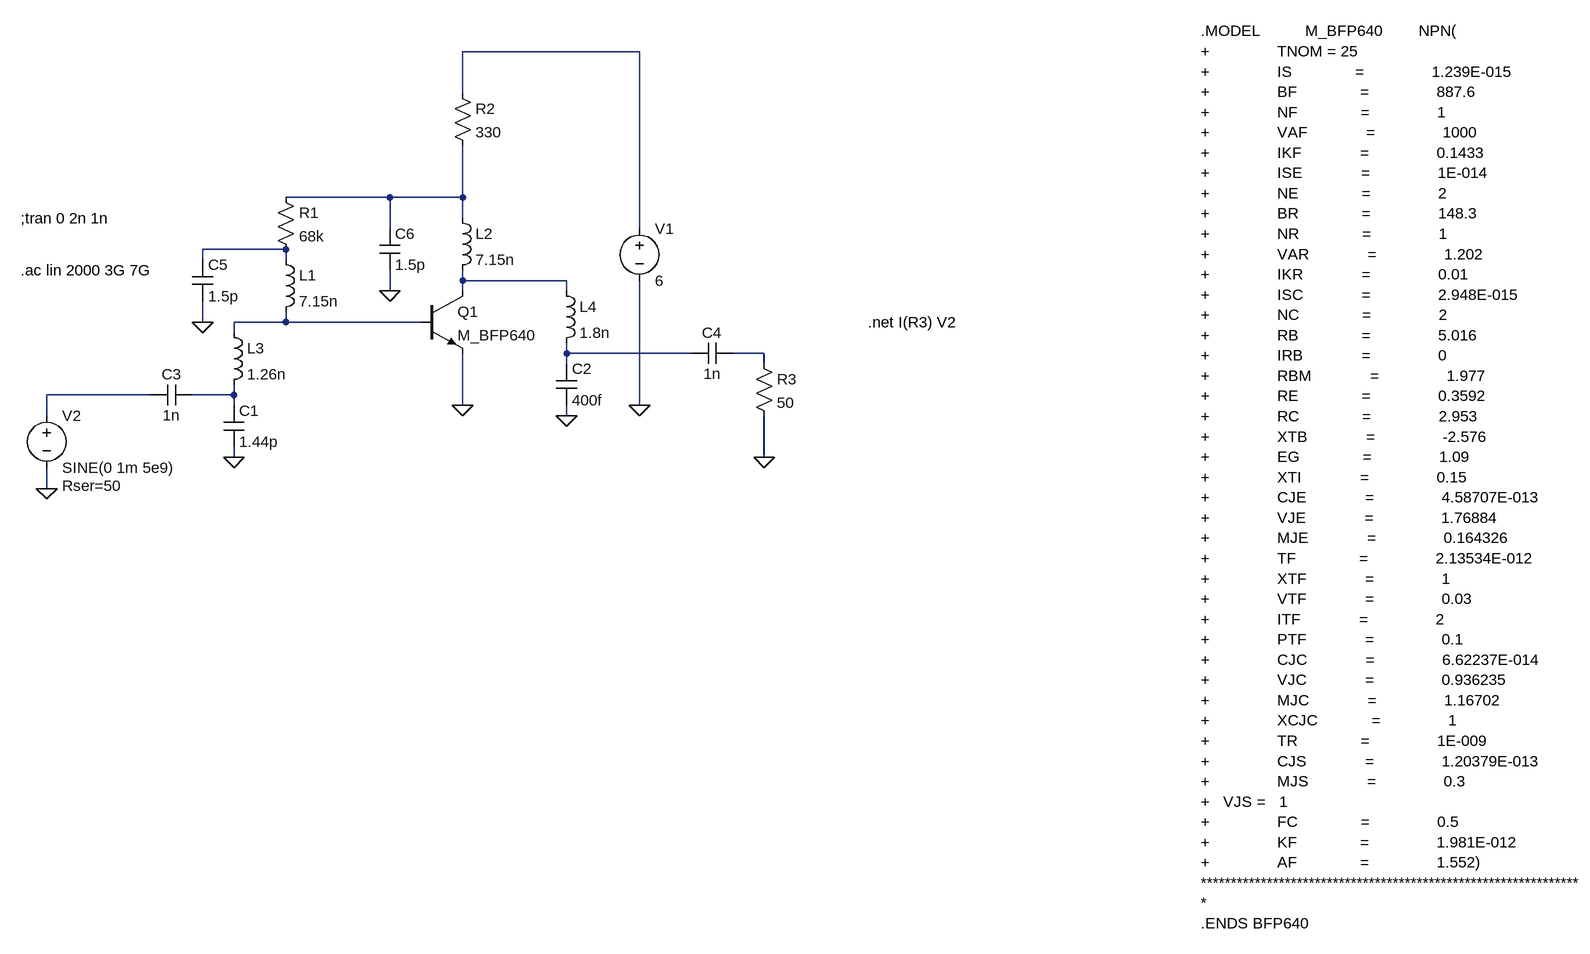
[diagram p0: schematic bfp640_single_stage_dcop.asc]
bfp640_single_stage_dcop.asc, the LTspice schematic file:
Version 4
SHEET 1 1148 1300
WIRE -640 64 -912 64
WIRE -912 128 -912 64
WIRE -1024 288 -1184 288
WIRE -912 288 -912 208
WIRE -912 288 -1024 288
WIRE -912 320 -912 288
WIRE -1024 336 -1024 288
WIRE -640 336 -640 64
WIRE -1184 368 -1312 368
WIRE -1312 384 -1312 368
WIRE -1184 384 -1184 368
WIRE -912 416 -912 400
WIRE -752 416 -912 416
WIRE -1024 432 -1024 400
WIRE -912 432 -912 416
WIRE -752 432 -752 416
WIRE -1312 480 -1312 448
WIRE -1184 480 -1184 464
WIRE -1184 480 -1264 480
WIRE -976 480 -1184 480
WIRE -1264 496 -1264 480
WIRE -752 528 -752 512
WIRE -560 528 -752 528
WIRE -448 528 -496 528
WIRE -752 544 -752 528
WIRE -448 544 -448 528
WIRE -1392 592 -1552 592
WIRE -1264 592 -1264 576
WIRE -1264 592 -1328 592
WIRE -1264 608 -1264 592
WIRE -912 608 -912 528
WIRE -640 608 -640 416
WIRE -1552 624 -1552 592
WIRE -752 624 -752 608
WIRE -1264 688 -1264 672
WIRE -448 688 -448 624
WIRE -1552 736 -1552 704
FLAG -912 608 0
FLAG -640 608 0
FLAG -1264 688 0
FLAG -752 624 0
FLAG -1552 736 0
FLAG -448 688 0
FLAG -1312 480 0
FLAG -1024 432 0
DATAFLAG -912 560 ""
DATAFLAG -912 400 ""
SYMBOL res -1200 272 R0
SYMATTR InstName R1
SYMATTR Value 68k
SYMBOL res -928 112 R0
SYMATTR InstName R2
SYMATTR Value 330
SYMBOL npn -976 432 R0
SYMATTR InstName Q1
SYMATTR Value M_BFP640
SYMBOL voltage -640 320 R0
WINDOW 123 0 0 Left 0
WINDOW 39 0 0 Left 0
SYMATTR InstName V1
SYMATTR Value 6
SYMBOL ind -1200 368 R0
SYMATTR InstName L1
SYMATTR Value 7.15n
SYMBOL ind -928 304 R0
SYMATTR InstName L2
SYMATTR Value 7.15n
SYMBOL ind -1280 480 R0
SYMATTR InstName L3
SYMATTR Value 1.26n
SYMBOL cap -1280 608 R0
SYMATTR InstName C1
SYMATTR Value 1.44p
SYMBOL cap -1328 576 R90
WINDOW 0 0 32 VBottom 2
WINDOW 3 32 32 VTop 2
SYMATTR InstName C3
SYMATTR Value 1n
SYMBOL cap -496 512 R90
WINDOW 0 0 32 VBottom 2
WINDOW 3 32 32 VTop 2
SYMATTR InstName C4
SYMATTR Value 1n
SYMBOL voltage -1552 608 R0
WINDOW 123 0 0 Left 0
WINDOW 39 24 124 Left 2
SYMATTR InstName V2
SYMATTR Value SINE(0 1m 5e9)
SYMATTR SpiceLine Rser=50
SYMBOL res -464 528 R0
SYMATTR InstName R3
SYMATTR Value 50
SYMBOL cap -768 544 R0
SYMATTR InstName C2
SYMATTR Value 400f
SYMBOL ind -768 416 R0
SYMATTR InstName L4
SYMATTR Value 1.8n
SYMBOL cap -1328 384 R0
SYMATTR InstName C5
SYMATTR Value 1.5p
SYMBOL cap -1040 336 R0
SYMATTR InstName C6
SYMATTR Value 1.5p
TEXT 224 32 Left 2 !.MODEL          M_BFP640        NPN(\n+               TNOM = 25\n+               IS              =               1.239E-015\n+               BF              =               887.6\n+               NF              =               1\n+               VAF             =               1000\n+               IKF             =               0.1433\n+               ISE             =               1E-014\n+               NE              =               2\n+               BR              =               148.3\n+               NR              =               1\n+               VAR             =               1.202\n+               IKR             =               0.01\n+               ISC             =               2.948E-015\n+               NC              =               2\n+               RB              =               5.016\n+               IRB             =               0\n+               RBM             =               1.977\n+               RE              =               0.3592\n+               RC              =               2.953\n+               XTB             =               -2.576\n+               EG              =               1.09\n+               XTI             =               0.15\n+               CJE             =               4.58707E-013\n+               VJE             =               1.76884\n+               MJE             =               0.164326\n+               TF              =               2.13534E-012\n+               XTF             =               1\n+               VTF             =               0.03\n+               ITF             =               2\n+               PTF             =               0.1\n+               CJC             =               6.62237E-014\n+               VJC             =               0.936235\n+               MJC             =               1.16702\n+               XCJC            =               1\n+               TR              =               1E-009\n+               CJS             =               1.20379E-013\n+               MJS             =               0.3\n+   VJS =   1\n+               FC              =               0.5\n+               KF              =               1.981E-012\n+               AF              =               1.552)\n***************************************************************\n*\n.ENDS BFP640
TEXT -1592 320 Left 2 !;tran 0 2n 1n
TEXT -288 480 Left 2 !.net I(R3) V2
TEXT -1592 400 Left 2 !.ac lin 2000 3G 7G

The netlist it stands for:
* bfp640_single_stage_dcop.asc
R1 N002 N003 68k
R2 N001 N002 330
Q1 N004 N005 0 0 M_BFP640
V1 N001 0 6
L1 N003 N005 7.15n
L2 N002 N004 7.15n
L3 N005 N009 1.26n
C1 N009 0 1.44p
C3 N009 N008 1n
C4 N007 N006 1n
V2 N008 0 SINE(0 1m 5e9) Rser=50
R3 N007 0 50
C2 N006 0 400f
L4 N004 N006 1.8n
C5 N003 0 1.5p
C6 N002 0 1.5p
.model NPN NPN
.model PNP PNP
.lib standard.bjt
.MODEL          M_BFP640        NPN(
+               TNOM = 25
+               IS              =               1.239E-015
+               BF              =               887.6
+               NF              =               1
+               VAF             =               1000
+               IKF             =               0.1433
+               ISE             =               1E-014
+               NE              =               2
+               BR              =               148.3
+               NR              =               1
+               VAR             =               1.202
+               IKR             =               0.01
+               ISC             =               2.948E-015
+               NC              =               2
+               RB              =               5.016
+               IRB             =               0
+               RBM             =               1.977
+               RE              =               0.3592
+               RC              =               2.953
+               XTB             =               -2.576
+               EG              =               1.09
+               XTI             =               0.15
+               CJE             =               4.58707E-013
+               VJE             =               1.76884
+               MJE             =               0.164326
+               TF              =               2.13534E-012
+               XTF             =               1
+               VTF             =               0.03
+               ITF             =               2
+               PTF             =               0.1
+               CJC             =               6.62237E-014
+               VJC             =               0.936235
+               MJC             =               1.16702
+               XCJC            =               1
+               TR              =               1E-009
+               CJS             =               1.20379E-013
+               MJS             =               0.3
+   VJS =   1
+               FC              =               0.5
+               KF              =               1.981E-012
+               AF              =               1.552)
***************************************************************
*
.ENDS BFP640
;tran 0 2n 1n
.net I(R3) V2
.ac lin 2000 3G 7G
.backanno
.end